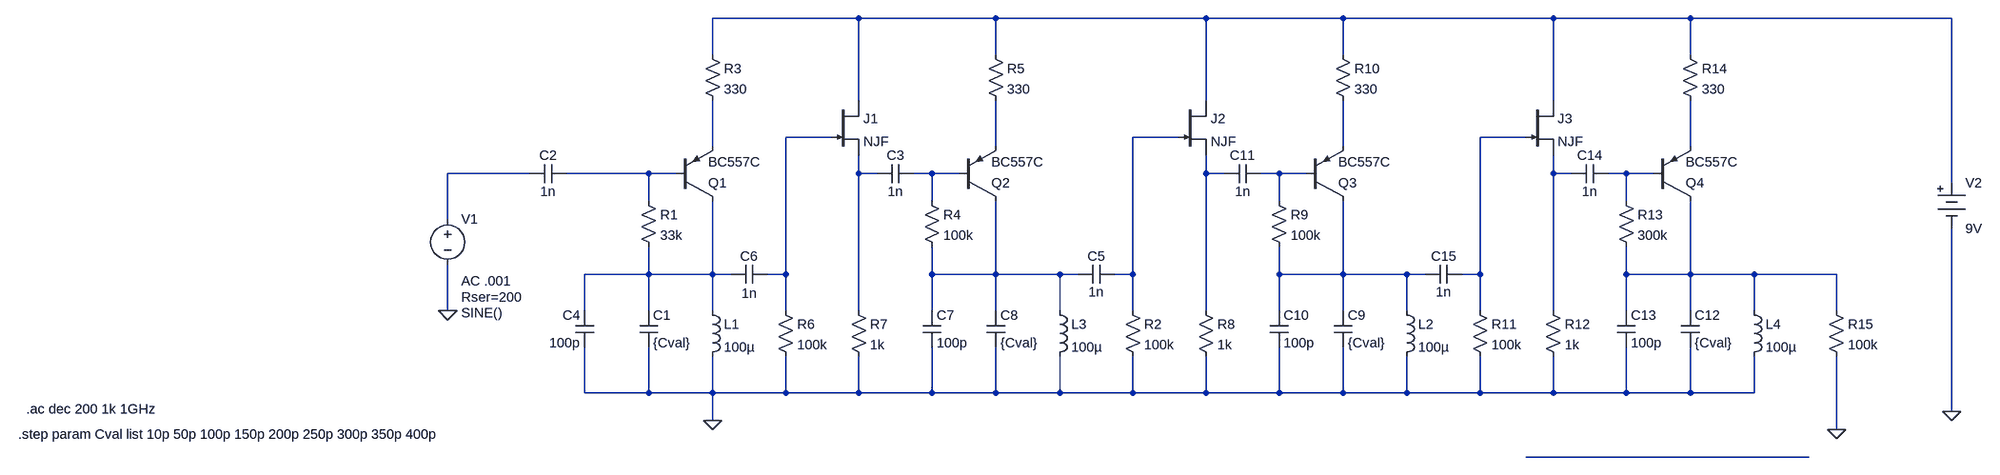
[diagram p0: schematic big-direct-conversion-receiver.asc]
big-direct-conversion-receiver.asc, the LTspice schematic file:
Version 4
SHEET 1 4168 680
WIRE 1360 -256 1104 -256
WIRE 1600 -256 1360 -256
WIRE 1968 -256 1600 -256
WIRE 2208 -256 1968 -256
WIRE 2576 -256 2208 -256
WIRE 2816 -256 2576 -256
WIRE 4112 -256 2816 -256
WIRE 1104 -192 1104 -256
WIRE 1600 -192 1600 -256
WIRE 2208 -192 2208 -256
WIRE 2816 -192 2816 -256
WIRE 1360 -112 1360 -256
WIRE 1968 -112 1968 -256
WIRE 2576 -112 2576 -256
WIRE 1312 -48 1232 -48
WIRE 1920 -48 1840 -48
WIRE 2528 -48 2448 -48
WIRE 1104 -32 1104 -112
WIRE 1600 -32 1600 -112
WIRE 2208 -32 2208 -112
WIRE 2816 -32 2816 -112
WIRE 784 16 640 16
WIRE 992 16 848 16
WIRE 1040 16 992 16
WIRE 1360 16 1360 -16
WIRE 1392 16 1360 16
WIRE 1488 16 1456 16
WIRE 1536 16 1488 16
WIRE 1968 16 1968 -16
WIRE 2000 16 1968 16
WIRE 2096 16 2064 16
WIRE 2144 16 2096 16
WIRE 2576 16 2576 -16
WIRE 2608 16 2576 16
WIRE 2704 16 2672 16
WIRE 2752 16 2704 16
WIRE 4112 32 4112 -256
WIRE 992 64 992 16
WIRE 1488 64 1488 16
WIRE 2096 64 2096 16
WIRE 2704 64 2704 16
WIRE 640 96 640 16
WIRE 992 192 992 144
WIRE 992 192 880 192
WIRE 1104 192 1104 64
WIRE 1104 192 992 192
WIRE 1136 192 1104 192
WIRE 1232 192 1232 -48
WIRE 1232 192 1200 192
WIRE 1488 192 1488 144
WIRE 1600 192 1600 64
WIRE 1600 192 1488 192
WIRE 1712 192 1600 192
WIRE 1744 192 1712 192
WIRE 1840 192 1840 -48
WIRE 1840 192 1808 192
WIRE 2096 192 2096 144
WIRE 2208 192 2208 64
WIRE 2208 192 2096 192
WIRE 2320 192 2208 192
WIRE 2352 192 2320 192
WIRE 2448 192 2448 -48
WIRE 2448 192 2416 192
WIRE 2704 192 2704 144
WIRE 2816 192 2816 64
WIRE 2816 192 2704 192
WIRE 2928 192 2816 192
WIRE 3072 192 2928 192
WIRE 640 256 640 176
WIRE 880 256 880 192
WIRE 992 256 992 192
WIRE 1104 256 1104 192
WIRE 1232 256 1232 192
WIRE 1360 256 1360 16
WIRE 1488 256 1488 192
WIRE 1600 256 1600 192
WIRE 1712 256 1712 192
WIRE 1840 256 1840 192
WIRE 1968 256 1968 16
WIRE 2096 256 2096 192
WIRE 2208 256 2208 192
WIRE 2320 256 2320 192
WIRE 2448 256 2448 192
WIRE 2576 256 2576 16
WIRE 2704 256 2704 192
WIRE 2816 256 2816 192
WIRE 2928 256 2928 192
WIRE 3072 256 3072 192
WIRE 880 400 880 320
WIRE 992 400 992 320
WIRE 992 400 880 400
WIRE 1104 400 1104 336
WIRE 1104 400 992 400
WIRE 1232 400 1232 336
WIRE 1232 400 1104 400
WIRE 1360 400 1360 336
WIRE 1360 400 1232 400
WIRE 1488 400 1488 320
WIRE 1488 400 1360 400
WIRE 1600 400 1600 320
WIRE 1600 400 1488 400
WIRE 1712 400 1712 336
WIRE 1712 400 1600 400
WIRE 1840 400 1840 336
WIRE 1840 400 1712 400
WIRE 1968 400 1968 336
WIRE 1968 400 1840 400
WIRE 2096 400 2096 320
WIRE 2096 400 1968 400
WIRE 2208 400 2208 320
WIRE 2208 400 2096 400
WIRE 2320 400 2320 336
WIRE 2320 400 2208 400
WIRE 2448 400 2448 336
WIRE 2448 400 2320 400
WIRE 2576 400 2576 336
WIRE 2576 400 2448 400
WIRE 2704 400 2704 320
WIRE 2704 400 2576 400
WIRE 2816 400 2816 320
WIRE 2816 400 2704 400
WIRE 2928 400 2928 336
WIRE 2928 400 2816 400
WIRE 4112 432 4112 112
WIRE 1104 448 1104 400
WIRE 3072 464 3072 336
WIRE 3024 512 2528 512
FLAG 640 256 0
FLAG 1104 448 0
FLAG 4112 432 0
FLAG 3072 464 0
SYMBOL cap 976 256 R0
SYMATTR InstName C1
SYMATTR Value {Cval}
SYMBOL ind 1088 240 R0
SYMATTR InstName L1
SYMATTR Value 100µ
SYMBOL voltage 640 80 R0
WINDOW 3 24 180 Left 2
WINDOW 123 24 124 Left 2
WINDOW 39 24 152 Left 2
SYMATTR InstName V1
SYMATTR Value SINE()
SYMATTR Value2 AC .001
SYMATTR SpiceLine Rser=200
SYMBOL pnp 1040 64 M180
SYMATTR InstName Q1
SYMATTR Value BC557C
SYMBOL res 976 48 R0
SYMATTR InstName R1
SYMATTR Value 33k
SYMBOL res 1088 -208 R0
SYMATTR InstName R3
SYMATTR Value 330
SYMBOL Misc\\battery 4112 16 R0
WINDOW 123 0 0 Left 0
WINDOW 39 0 0 Left 0
SYMATTR InstName V2
SYMATTR Value 9V
SYMBOL cap 896 320 R180
WINDOW 0 24 56 Left 2
WINDOW 3 24 8 Left 2
SYMATTR InstName C4
SYMATTR Value 100p
SYMBOL cap 848 0 R90
WINDOW 0 0 32 VBottom 2
WINDOW 3 32 32 VTop 2
SYMATTR InstName C2
SYMATTR Value 1n
SYMBOL pnp 1536 64 M180
SYMATTR InstName Q2
SYMATTR Value BC557C
SYMBOL res 1472 48 R0
SYMATTR InstName R4
SYMATTR Value 100k
SYMBOL res 1584 -208 R0
SYMATTR InstName R5
SYMATTR Value 330
SYMBOL cap 1584 256 R0
SYMATTR InstName C8
SYMATTR Value {Cval}
SYMBOL ind 1696 240 R0
SYMATTR InstName L3
SYMATTR Value 100µ
SYMBOL cap 1808 176 R90
WINDOW 0 0 32 VBottom 2
WINDOW 3 32 32 VTop 2
SYMATTR InstName C5
SYMATTR Value 1n
SYMBOL cap 1136 208 R270
WINDOW 0 32 32 VTop 2
WINDOW 3 -2 32 VBottom 2
SYMATTR InstName C6
SYMATTR Value 1n
SYMBOL njf 1312 -112 R0
SYMATTR InstName J1
SYMBOL res 1216 240 R0
SYMATTR InstName R6
SYMATTR Value 100k
SYMBOL res 1344 240 R0
SYMATTR InstName R7
SYMATTR Value 1k
SYMBOL cap 1392 32 R270
WINDOW 0 32 32 VTop 2
WINDOW 3 0 32 VBottom 2
SYMATTR InstName C3
SYMATTR Value 1n
SYMBOL cap 1472 256 R0
SYMATTR InstName C7
SYMATTR Value 100p
SYMBOL njf 1920 -112 R0
SYMATTR InstName J2
SYMBOL res 1824 240 R0
SYMATTR InstName R2
SYMATTR Value 100k
SYMBOL res 1952 240 R0
SYMATTR InstName R8
SYMATTR Value 1k
SYMBOL pnp 2144 64 M180
SYMATTR InstName Q3
SYMATTR Value BC557C
SYMBOL res 2080 48 R0
SYMATTR InstName R9
SYMATTR Value 100k
SYMBOL res 2192 -208 R0
SYMATTR InstName R10
SYMATTR Value 330
SYMBOL cap 2192 256 R0
SYMATTR InstName C9
SYMATTR Value {Cval}
SYMBOL ind 2304 240 R0
SYMATTR InstName L2
SYMATTR Value 100µ
SYMBOL cap 2080 256 R0
SYMATTR InstName C10
SYMATTR Value 100p
SYMBOL cap 2000 32 R270
WINDOW 0 32 32 VTop 2
WINDOW 3 0 32 VBottom 2
SYMATTR InstName C11
SYMATTR Value 1n
SYMBOL njf 2528 -112 R0
SYMATTR InstName J3
SYMBOL res 2432 240 R0
SYMATTR InstName R11
SYMATTR Value 100k
SYMBOL res 2560 240 R0
SYMATTR InstName R12
SYMATTR Value 1k
SYMBOL pnp 2752 64 M180
SYMATTR InstName Q4
SYMATTR Value BC557C
SYMBOL res 2688 48 R0
SYMATTR InstName R13
SYMATTR Value 300k
SYMBOL res 2800 -208 R0
SYMATTR InstName R14
SYMATTR Value 330
SYMBOL cap 2800 256 R0
SYMATTR InstName C12
SYMATTR Value {Cval}
SYMBOL ind 2912 240 R0
SYMATTR InstName L4
SYMATTR Value 100µ
SYMBOL cap 2688 256 R0
SYMATTR InstName C13
SYMATTR Value 100p
SYMBOL cap 2608 32 R270
WINDOW 0 32 32 VTop 2
WINDOW 3 0 32 VBottom 2
SYMATTR InstName C14
SYMATTR Value 1n
SYMBOL cap 2416 176 R90
WINDOW 0 0 32 VBottom 2
WINDOW 3 32 32 VTop 2
SYMATTR InstName C15
SYMATTR Value 1n
SYMBOL res 3056 240 R0
SYMATTR InstName R15
SYMATTR Value 100k
TEXT -112 472 Left 2 !.step param Cval list 10p 50p 100p 150p 200p 250p 300p 350p 400p
TEXT -98 428 Left 2 !.ac dec 200 1k 1GHz

The netlist it stands for:
* big-direct-conversion-receiver.asc
C1 N017 0 {Cval}
L1 N017 0 100µ
V1 N009 0 SINE() AC .001 Rser=200
Q1 N017 N010 N005 0 BC557C
R1 N010 N017 33k
R3 N001 N005 330
V2 N001 0 9V
C4 0 N017 100p
C2 N010 N009 1n
Q2 N018 N012 N006 0 BC557C
R4 N012 N018 100k
R5 N001 N006 330
C8 N018 0 {Cval}
L3 N018 0 100µ
C5 N003 N018 1n
C6 N017 N002 1n
J1 N001 N002 N011 NJF
R6 N002 0 100k
R7 N011 0 1k
C3 N011 N012 1n
C7 N018 0 100p
J2 N001 N003 N013 NJF
R2 N003 0 100k
R8 N013 0 1k
Q3 N019 N014 N007 0 BC557C
R9 N014 N019 100k
R10 N001 N007 330
C9 N019 0 {Cval}
L2 N019 0 100µ
C10 N019 0 100p
C11 N013 N014 1n
J3 N001 N004 N015 NJF
R11 N004 0 100k
R12 N015 0 1k
Q4 N020 N016 N008 0 BC557C
R13 N016 N020 300k
R14 N001 N008 330
C12 N020 0 {Cval}
L4 N020 0 100µ
C13 N020 0 100p
C14 N015 N016 1n
C15 N004 N019 1n
R15 N020 0 100k
.model NPN NPN
.model PNP PNP
.lib standard.bjt
.model NJF NJF
.model PJF PJF
.lib standard.jft
.step param Cval list 10p 50p 100p 150p 200p 250p 300p 350p 400p
.ac dec 200 1k 1GHz
.backanno
.end